# Altium schematic sheet Placa.SchDoc
size A3
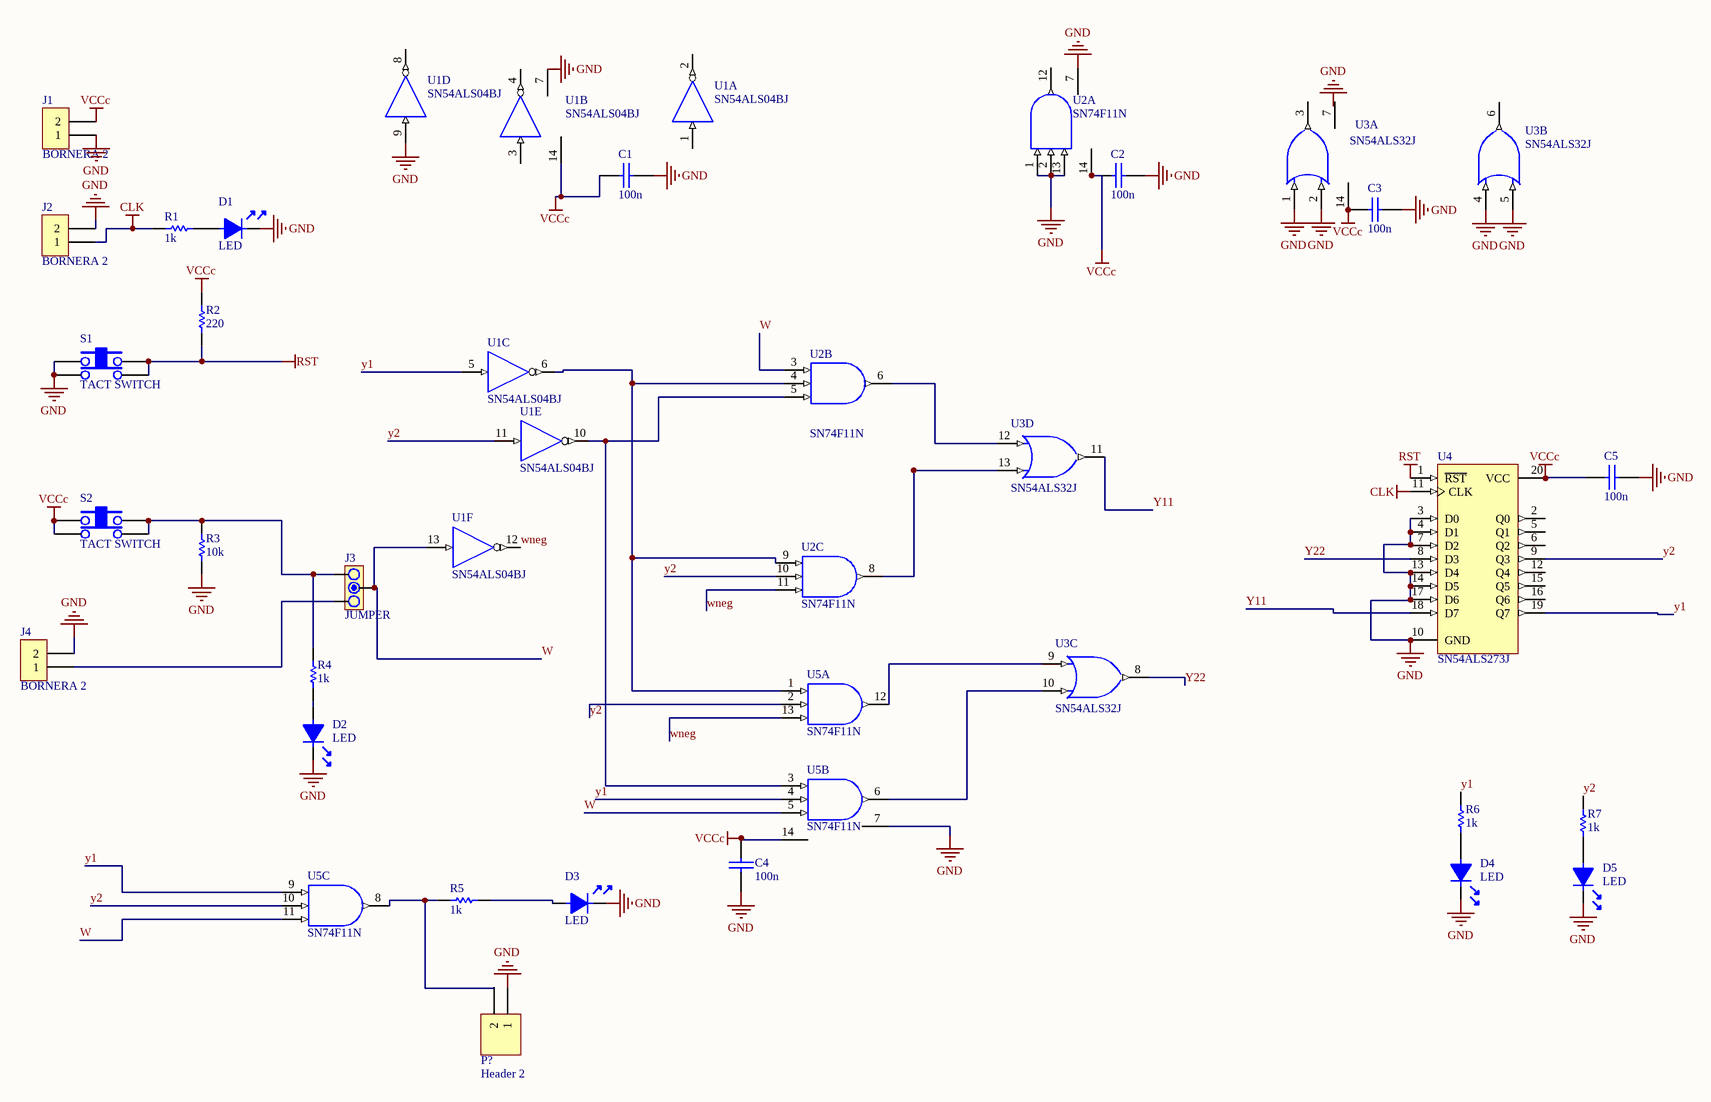
[diagram p0: Placa.SchDoc]

## Parts
C1  100n  [CAP200]
C2  100n  [CAP200]
C3  100n  [CAP200]
C4  100n  [CAP200]
C5  100n  [CAP200]
D1  LED  [LED5]
D2  LED  [LED5]
D3  LED  [LED5]
D4  LED  [LED5]
D5  LED  [LED5]
J1  BORNERA 2  [BORNERA2]
J2  BORNERA 2  [BORNERA2]
J3  JUMPER  [JUMPER3]
J4  BORNERA 2  [BORNERA2]
P?  Header 2  [HDR1X2]
R1  1k  [RES300]
R2  220  [RES300]
R3  10k  [RES300]
R4  1k  [RES300]
R5  1k  [RES300]
R6  1k  [RES300]
R7  1k  [RES300]
S1  TACT SWITCH  [TACTSWITCH]
S2  TACT SWITCH  [TACTSWITCH]
U1  SN54ALS04BJ  [J014]  (parts A,B,C,D,E,F of 6)
U2  SN74F11N  [N014]  (parts A,B,C of 3)
U3  SN54ALS32J  [J014]  (parts A,B,C,D of 4)
U4  SN54ALS273J  [J020]
U5  SN74F11N  [N014]  (parts A,B,C of 3)

## Nets
CLK: J2.1 R1.1 U4.11(CLK)
GND: C1.2 C2.1 C3.1 C4.1 C5.1 D1.2 D2.2 D3.2 D4.2 D5.2 J1.1 J2.2 J4.2 P?.1 R3.2 S1.1 S1.2 U1.7(GND) U1.9(A) U2.1(A) U2.2(B) U2.7(GND) U2.13(C) U3.1(A) U3.2(B) U3.4(A) U3.5(B) U3.7(GND) U4.3(D0) U4.4(D1) U4.7(D2) U4.10(GND) U4.13(D4) U4.14(D5) U4.17(D6) U5.7(GND)
RST: R2.2 S1.3 S1.4 U4.1(~{RST})
VCC: C1.1 C2.2 C3.2 C4.2 C5.2 J1.2 R2.1 S2.1 S2.2 U1.14(VCC) U2.14(VCC) U3.14(VCC) U4.20(VCC) U5.14(VCC)  [also labelled VCCc]
W: J3.2 U1.13(A) U2.3(A) U5.5(C) U5.11(C)
wneg: U1.12(Y) U2.11(C) U5.13(C)
y1: R6.1 U1.5(A) U4.19(Q7) U5.4(B) U5.9(A)
y2: R7.1 U1.11(A) U2.10(B) U4.9(Q3) U5.2(B) U5.10(B)
Y11: U3.11(Y) U4.18(D7)
Y22: U3.8(Y) U4.8(D3)
NetD1_1: D1.1 R1.2
NetD2_1: D2.1 R4.2
NetD3_1: D3.1 R5.2
NetD4_1: D4.1 R6.2
NetD5_1: D5.1 R7.2
NetJ3_1: J3.1 J4.1
NetJ3_3: J3.3 R3.1 R4.1 S2.3 S2.4
NetR5_1: R5.1 U5.8(Y)
NetU1_6: U1.6(Y) U2.4(B) U2.9(A) U5.1(A)
NetU1_10: U1.10(Y) U2.5(C) U5.3(A)
NetU2_6: U2.6(Y) U3.12(A)
NetU2_8: U2.8(Y) U3.13(B)
NetU3_9: U3.9(A) U5.12(Y)
NetU3_10: U3.10(B) U5.6(Y)

Not connected (* = marked no-connect by the designer): P? 2; U1 1(A) 2(Y) 3(A) 4(Y) 8(Y); U2 12(Y); U3 3(Y) 6(Y); U4 2(Q0) 5(Q1) 6(Q2) 12(Q4) 15(Q5) 16(Q6)

## Notes on the sheet
- Labels drawn without touching a wire or pin: GND

## Library data of the parts
C1-C5 = CAP
J3 = JUMPER3
P? = Header 2: Header, 2-Pin; LatestRevisionDate: 17-Jul-2002; LatestRevisionNote: Re-released for DXP Platform.; Publisher: Altium Limited
R1-R7 = RES
U1 = SN54ALS04BJ: Hex Inverter; Published: 8-Jun-2000; LatestRevisionDate: 04-Mar-2005; LatestRevisionNote: Stylized 3D Model Added.; DatasheetVersion: Dec-1994; PackageVersion: Jun-1999; PackageReference: J014; Publisher: Altium Limited; PackageDescription: DIP; 14 Leads; Row Spacing 7.62 mm; Pitch 2.54 mm; ComponentLink1Description: Manufacturer Link; ComponentLink1URL: http://www.ti.com/; ComponentLink2Description: Datasheet; ComponentLink2URL: http://www-s.ti.com/sc/ds/sn54as04.pdf; ComponentLink3Description: Packaging Specification; ComponentLink3URL: http://focus.ti.com/lit/ml/mcer002d/mcer002d.pdf
U2 U5 = SN74F11N: Triple 3-Input Positive-AND Gate; Published: 8-Jun-2000; LatestRevisionDate: 04-Mar-2005; LatestRevisionNote: Stylized 3D Model Added.; DatasheetVersion: Oct-1993; PackageVersion: Oct-1995; PackageReference: N014; Publisher: Altium Limited; PackageDescription: DIP; 14 Leads; Row Spacing 7.62 mm; Pitch 2.54 mm; ComponentLink1Description: Manufacturer Link; ComponentLink1URL: http://www.ti.com/; ComponentLink2Description: Datasheet; ComponentLink2URL: http://www-s.ti.com/sc/ds/SN74F11.pdf
U3 = SN54ALS32J: Quadruple 2-Input Positive-OR Gate; Published: 8-Jun-2000; LatestRevisionDate: 04-Mar-2005; LatestRevisionNote: Stylized 3D Model Added.; DatasheetVersion: Dec-1994; PackageVersion: Jun-1999; PackageReference: J014; Publisher: Altium Limited; PackageDescription: DIP; 14 Leads; Row Spacing 7.62 mm; Pitch 2.54 mm; ComponentLink1Description: Manufacturer Link; ComponentLink1URL: http://www.ti.com/; ComponentLink2Description: Datasheet; ComponentLink2URL: http://www-s.ti.com/sc/ds/sn74als32.pdf; ComponentLink3Description: Packaging Specification; ComponentLink3URL: http://focus.ti.com/lit/ml/mcer002d/mcer002d.pdf
U4 = SN54ALS273J: Octal D-Type Flip-Flop with Clear; Published: 8-Jun-2000; LatestRevisionDate: 04-Mar-2005; LatestRevisionNote: Stylized 3D Model Added.; DatasheetVersion: Dec-1994; PackageVersion: Jun-1999; PackageReference: J020; Publisher: Altium Limited; PackageDescription: DIP; 20 Leads; Row Spacing 7.62 mm; Pitch 2.54 mm; ComponentLink1Description: Manufacturer Link; ComponentLink1URL: http://www.ti.com/; ComponentLink2Description: Datasheet; ComponentLink2URL: http://www-s.ti.com/sc/ds/sn74als273.pdf